# Altium schematic sheet [06] - MEMORY.SchDoc
size A3; DocumentNumber: 3; SheetNumber: 3; SheetTotal: 4
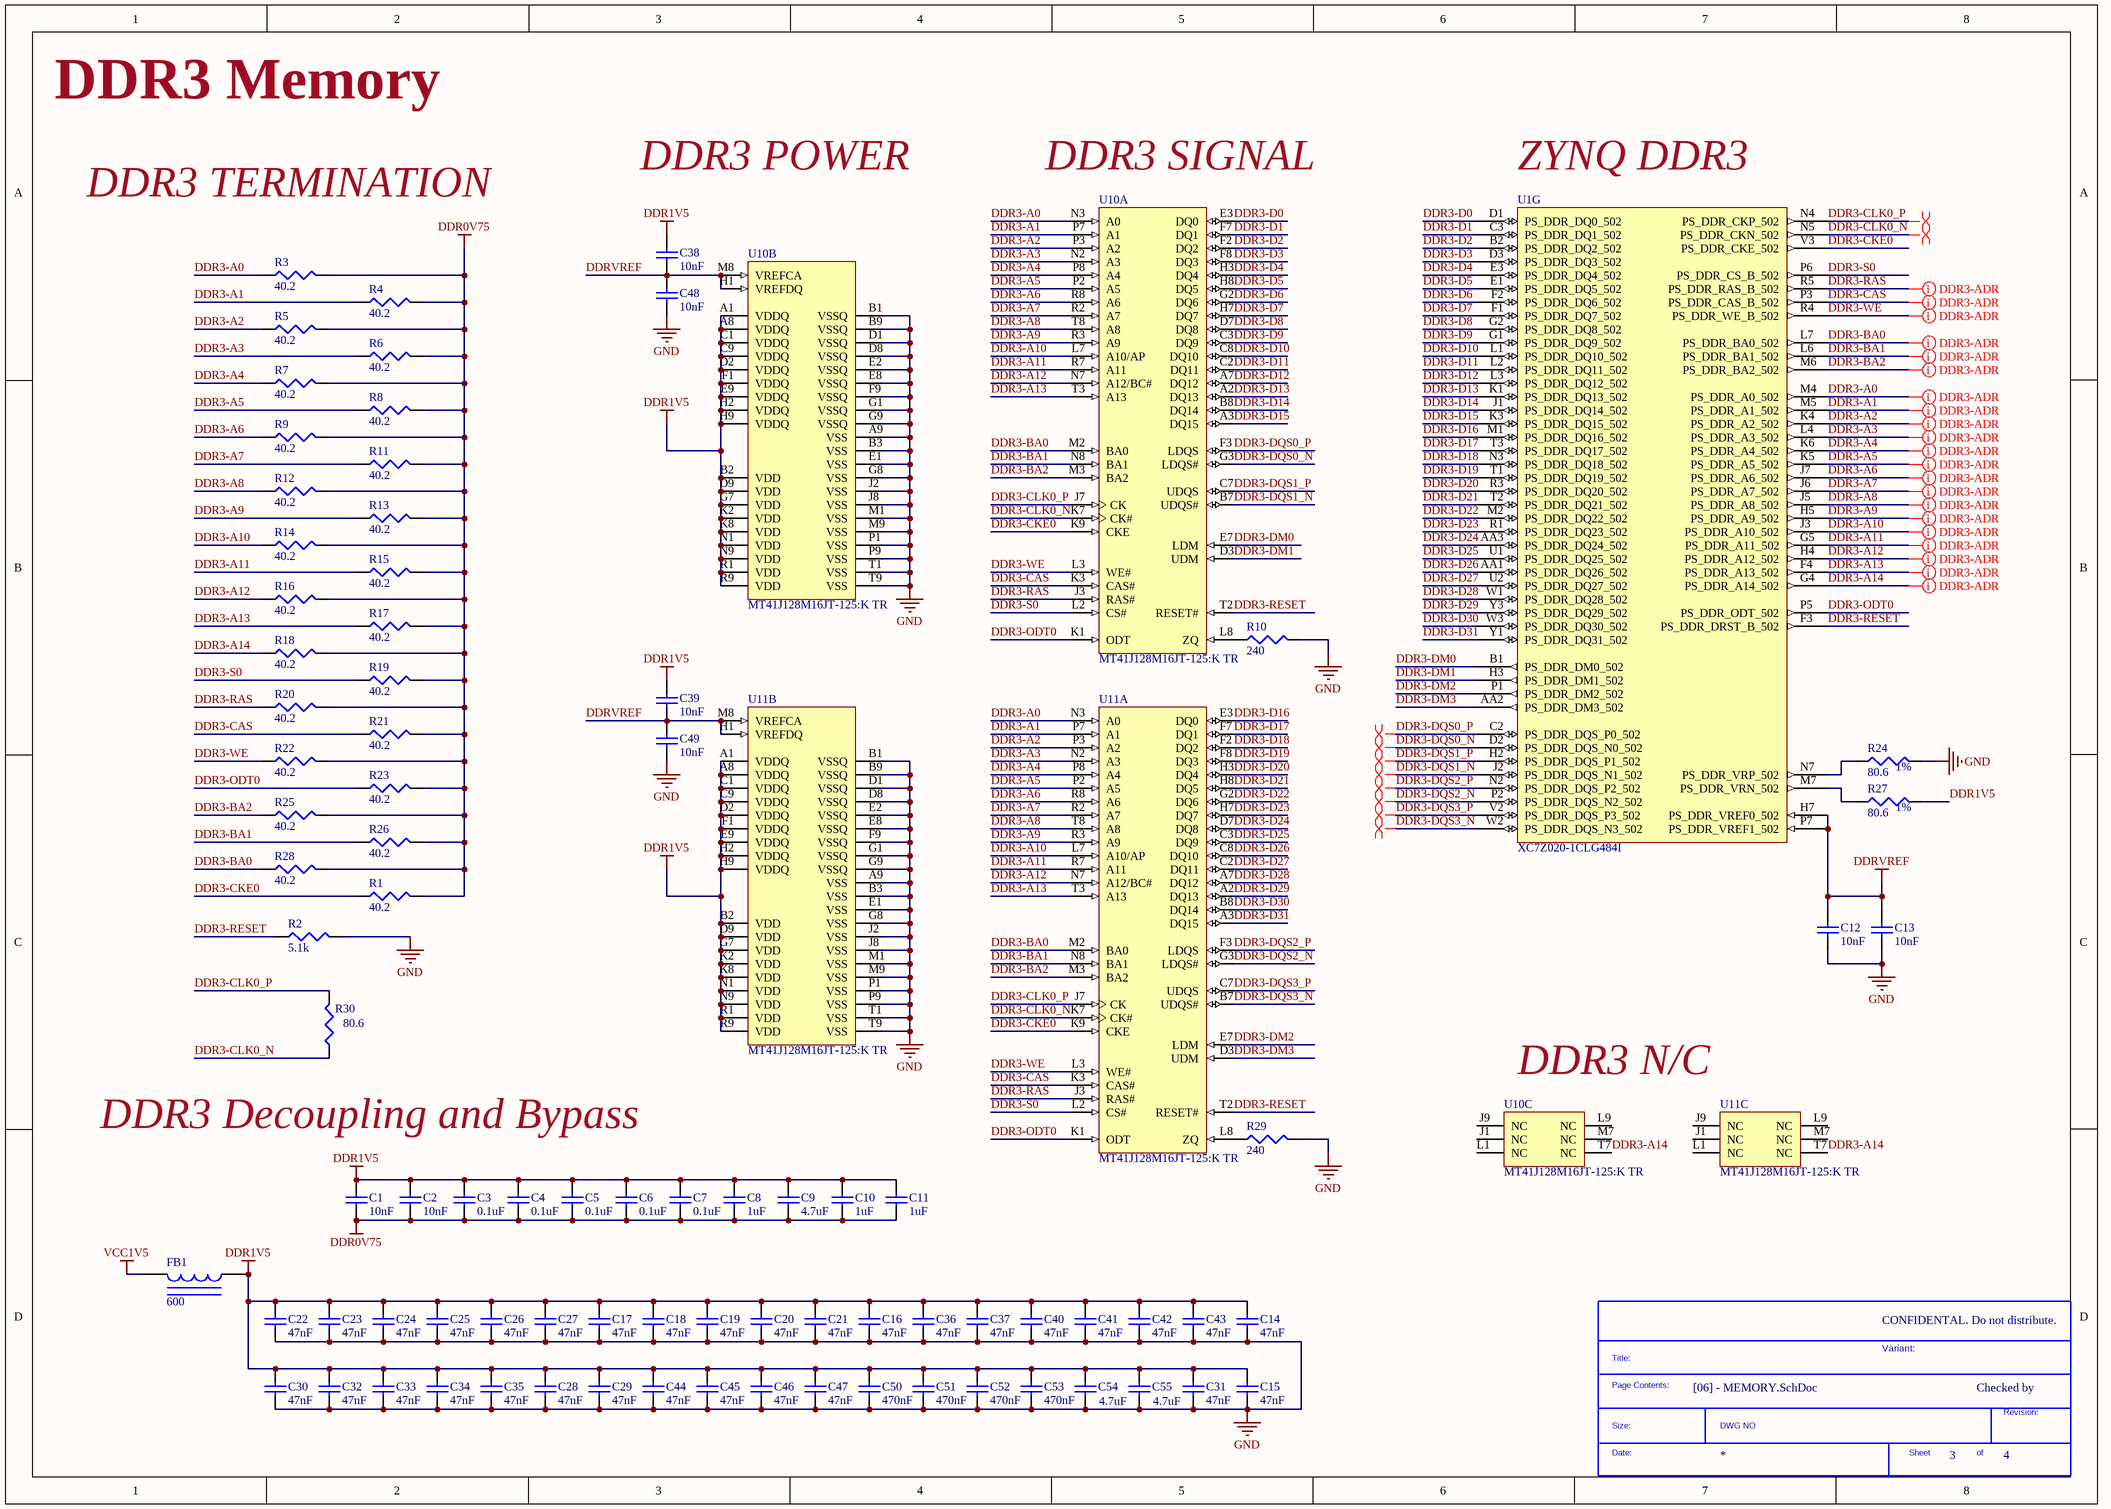
[diagram p0: [06] - MEMORY.SchDoc]

## Parts
*  SDTitleBlock  (value not drawn)  (graphical)
C1  value 10nF  [0402]  (hidden comment: Capacitor)
C2  value 10nF  [0402]  (hidden comment: Capacitor)
C3  value 0.1uF  [0402]  (hidden comment: Capacitor)
C4  value 0.1uF  [0402]  (hidden comment: Capacitor)
C5  value 0.1uF  [0402]  (hidden comment: Capacitor)
C6  value 0.1uF  [0402]  (hidden comment: Capacitor)
C7  value 0.1uF  [0402]  (hidden comment: Capacitor)
C8  value 1uF  [1608[0603]]  (hidden comment: Capacitor)
C9  value 4.7uF  [1608[0603]]  (hidden comment: Capacitor)
C10  value 1uF  [1608[0603]]  (hidden comment: Capacitor)
C11  value 1uF  [1608[0603]]  (hidden comment: Capacitor)
C12  value 10nF  [0402]  (hidden comment: Capacitor)
C13  value 10nF  [0402]  (hidden comment: Capacitor)
C14  value 47nF  [0402]  (hidden comment: Capacitor)
C15  value 47nF  [0402]  (hidden comment: Capacitor)
C16  value 47nF  [0402]  (hidden comment: Capacitor)
C17  value 47nF  [0402]  (hidden comment: Capacitor)
C18  value 47nF  [0402]  (hidden comment: Capacitor)
C19  value 47nF  [0402]  (hidden comment: Capacitor)
C20  value 47nF  [0402]  (hidden comment: Capacitor)
C21  value 47nF  [0402]  (hidden comment: Capacitor)
C22  value 47nF  [0402]  (hidden comment: Capacitor)
C23  value 47nF  [0402]  (hidden comment: Capacitor)
C24  value 47nF  [0402]  (hidden comment: Capacitor)
C25  value 47nF  [0402]  (hidden comment: Capacitor)
C26  value 47nF  [0402]  (hidden comment: Capacitor)
C27  value 47nF  [0402]  (hidden comment: Capacitor)
C28  value 47nF  [0402]  (hidden comment: Capacitor)
C29  value 47nF  [0402]  (hidden comment: Capacitor)
C30  value 47nF  [0402]  (hidden comment: Capacitor)
C31  value 47nF  [0402]  (hidden comment: Capacitor)
C32  value 47nF  [0402]  (hidden comment: Capacitor)
C33  value 47nF  [0402]  (hidden comment: Capacitor)
C34  value 47nF  [0402]  (hidden comment: Capacitor)
C35  value 47nF  [0402]  (hidden comment: Capacitor)
C36  value 47nF  [0402]  (hidden comment: Capacitor)
C37  value 47nF  [0402]  (hidden comment: Capacitor)
C38  value 10nF  [0402]  (hidden comment: Capacitor)
C39  value 10nF  [0402]  (hidden comment: Capacitor)
C40  value 47nF  [0402]  (hidden comment: Capacitor)
C41  value 47nF  [0402]  (hidden comment: Capacitor)
C42  value 47nF  [0402]  (hidden comment: Capacitor)
C43  value 47nF  [0402]  (hidden comment: Capacitor)
C44  value 47nF  [0402]  (hidden comment: Capacitor)
C45  value 47nF  [0402]  (hidden comment: Capacitor)
C46  value 47nF  [0402]  (hidden comment: Capacitor)
C47  value 47nF  [0402]  (hidden comment: Capacitor)
C48  value 10nF  [0402]  (hidden comment: Capacitor)
C49  value 10nF  [0402]  (hidden comment: Capacitor)
C50  value 470nF  [0402]  (hidden comment: Capacitor)
C51  value 470nF  [0402]  (hidden comment: Capacitor)
C52  value 470nF  [0402]  (hidden comment: Capacitor)
C53  value 470nF  [0402]  (hidden comment: Capacitor)
C54  value 4.7uF  [1608[0603]]  (hidden comment: Capacitor)
C55  value 4.7uF  [1608[0603]]  (hidden comment: Capacitor)
FB1  value 600  [6-0805_N]  (hidden comment: Ferrite Bead)
R1  value 40.2  [0402]  (hidden comment: Resistor)
R2  value 5.1k  [0402]  (hidden comment: Resistor)
R3  value 40.2  [0402]  (hidden comment: Resistor)
R4  value 40.2  [0402]  (hidden comment: Resistor)
R5  value 40.2  [0402]  (hidden comment: Resistor)
R6  value 40.2  [0402]  (hidden comment: Resistor)
R7  value 40.2  [0402]  (hidden comment: Resistor)
R8  value 40.2  [0402]  (hidden comment: Resistor)
R9  value 40.2  [0402]  (hidden comment: Resistor)
R10  value 240  [0402]  (hidden comment: Resistor)
R11  value 40.2  [0402]  (hidden comment: Resistor)
R12  value 40.2  [0402]  (hidden comment: Resistor)
R13  value 40.2  [0402]  (hidden comment: Resistor)
R14  value 40.2  [0402]  (hidden comment: Resistor)
R15  value 40.2  [0402]  (hidden comment: Resistor)
R16  value 40.2  [0402]  (hidden comment: Resistor)
R17  value 40.2  [0402]  (hidden comment: Resistor)
R18  value 40.2  [0402]  (hidden comment: Resistor)
R19  value 40.2  [0402]  (hidden comment: Resistor)
R20  value 40.2  [0402]  (hidden comment: Resistor)
R21  value 40.2  [0402]  (hidden comment: Resistor)
R22  value 40.2  [0402]  (hidden comment: Resistor)
R23  value 40.2  [0402]  (hidden comment: Resistor)
R24  value 80.6  Tolerance: 1%  [0402]  (hidden comment: Resistor)
R25  value 40.2  [0402]  (hidden comment: Resistor)
R26  value 40.2  [0402]  (hidden comment: Resistor)
R27  value 80.6  Tolerance: 1%  [0402]  (hidden comment: Resistor)
R28  value 40.2  [0402]  (hidden comment: Resistor)
R29  value 240  [0402]  (hidden comment: Resistor)
R30  value 80.6  [0402]  (hidden comment: Resistor)
U1  XC7Z020-1CLG484I  [CLG484]  (part G of 10)
U10  MT41J128M16JT-125:K TR  [MICT-JT-96]  (parts A,B,C of 3)
U11  MT41J128M16JT-125:K TR  [MICT-JT-96]  (parts A,B,C of 3)

## Nets
DDR0V75: C1.1 C2.1 C3.1 C4.1 C5.1 C6.1 C7.1 C8.1 C9.1 C10.1 C11.1 R1.2 R3.2 R4.2 R5.2 R6.2 R7.2 R8.2 R9.2 R11.2 R12.2 R13.2 R14.2 R15.2 R16.2 R17.2 R18.2 R19.2 R20.2 R21.2 R22.2 R23.2 R25.2 R26.2 R28.2
DDR1V5: C1.2 C2.2 C3.2 C4.2 C5.2 C6.2 C7.2 C8.2 C9.2 C10.2 C11.2 C14.2 C15.2 C16.2 C17.2 C18.2 C19.2 C20.2 C21.2 C22.2 C23.2 C24.2 C25.2 C26.2 C27.2 C28.2 C29.2 C30.2 C31.2 C32.2 C33.2 C34.2 C35.2 C36.2 C37.2 C38.2 C39.2 C40.2 C41.2 C42.2 C43.2 C44.2 C45.2 C46.2 C47.2 C50.2 C51.2 C52.2 C53.2 C54.2 C55.2 FB1.1 R27.2 U10.A1(VDDQ) U10.A8(VDDQ) U10.B2(VDD) U10.C1(VDDQ) U10.C9(VDDQ) U10.D2(VDDQ) U10.D9(VDD) U10.E9(VDDQ) U10.F1(VDDQ) U10.G7(VDD) U10.H2(VDDQ) U10.H9(VDDQ) U10.K2(VDD) U10.K8(VDD) U10.N1(VDD) U10.N9(VDD) U10.R1(VDD) U10.R9(VDD) U11.A1(VDDQ) U11.A8(VDDQ) U11.B2(VDD) U11.C1(VDDQ) U11.C9(VDDQ) U11.D2(VDDQ) U11.D9(VDD) U11.E9(VDDQ) U11.F1(VDDQ) U11.G7(VDD) U11.H2(VDDQ) U11.H9(VDDQ) U11.K2(VDD) U11.K8(VDD) U11.N1(VDD) U11.N9(VDD) U11.R1(VDD) U11.R9(VDD)
DDRVREF: C12.2 C13.2 C38.1 C39.1 C48.2 C49.2 U1.H7(PS_DDR_VREF0_502) U1.P7(PS_DDR_VREF1_502) U10.H1(VREFDQ) U10.M8(VREFCA) U11.H1(VREFDQ) U11.M8(VREFCA)
GND: C12.1 C13.1 C14.1 C15.1 C16.1 C17.1 C18.1 C19.1 C20.1 C21.1 C22.1 C23.1 C24.1 C25.1 C26.1 C27.1 C28.1 C29.1 C30.1 C31.1 C32.1 C33.1 C34.1 C35.1 C36.1 C37.1 C40.1 C41.1 C42.1 C43.1 C44.1 C45.1 C46.1 C47.1 C48.1 C49.1 C50.1 C51.1 C52.1 C53.1 C54.1 C55.1 R2.2 R10.2 R24.2 R29.2 U10.A9(VSS) U10.B1(VSSQ) U10.B3(VSS) U10.B9(VSSQ) U10.D1(VSSQ) U10.D8(VSSQ) U10.E1(VSS) U10.E2(VSSQ) U10.E8(VSSQ) U10.F9(VSSQ) U10.G1(VSSQ) U10.G8(VSS) U10.G9(VSSQ) U10.J2(VSS) U10.J8(VSS) U10.M1(VSS) U10.M9(VSS) U10.P1(VSS) U10.P9(VSS) U10.T1(VSS) U10.T9(VSS) U11.A9(VSS) U11.B1(VSSQ) U11.B3(VSS) U11.B9(VSSQ) U11.D1(VSSQ) U11.D8(VSSQ) U11.E1(VSS) U11.E2(VSSQ) U11.E8(VSSQ) U11.F9(VSSQ) U11.G1(VSSQ) U11.G8(VSS) U11.G9(VSSQ) U11.J2(VSS) U11.J8(VSS) U11.M1(VSS) U11.M9(VSS) U11.P1(VSS) U11.P9(VSS) U11.T1(VSS) U11.T9(VSS)
VCC1V5: FB1.2
DDR3-A0: R3.1 U1.M4(PS_DDR_A0_502) U10.N3(A0) U11.N3(A0)
DDR3-A1: R4.1 U1.M5(PS_DDR_A1_502) U10.P7(A1) U11.P7(A1)
DDR3-A2: R5.1 U1.K4(PS_DDR_A2_502) U10.P3(A2) U11.P3(A2)
DDR3-A3: R6.1 U1.L4(PS_DDR_A3_502) U10.N2(A3) U11.N2(A3)
DDR3-A4: R7.1 U1.K6(PS_DDR_A4_502) U10.P8(A4) U11.P8(A4)
DDR3-A5: R8.1 U1.K5(PS_DDR_A5_502) U10.P2(A5) U11.P2(A5)
DDR3-A6: R9.1 U1.J7(PS_DDR_A6_502) U10.R8(A6) U11.R8(A6)
DDR3-A7: R11.1 U1.J6(PS_DDR_A7_502) U10.R2(A7) U11.R2(A7)
DDR3-A8: R12.1 U1.J5(PS_DDR_A8_502) U10.T8(A8) U11.T8(A8)
DDR3-A9: R13.1 U1.H5(PS_DDR_A9_502) U10.R3(A9) U11.R3(A9)
DDR3-A10: R14.1 U1.J3(PS_DDR_A10_502) U10.L7(A10/AP) U11.L7(A10/AP)
DDR3-A11: R15.1 U1.G5(PS_DDR_A11_502) U10.R7(A11) U11.R7(A11)
DDR3-A12: R16.1 U1.H4(PS_DDR_A12_502) U10.N7(A12/BC#) U11.N7(A12/BC#)
DDR3-A13: R17.1 U1.F4(PS_DDR_A13_502) U10.T3(A13) U11.T3(A13)
DDR3-A14: R18.1 U1.G4(PS_DDR_A14_502) U10.T7(NC) U11.T7(NC)
DDR3-BA0: R28.1 U1.L7(PS_DDR_BA0_502) U10.M2(BA0) U11.M2(BA0)
DDR3-BA1: R26.1 U1.L6(PS_DDR_BA1_502) U10.N8(BA1) U11.N8(BA1)
DDR3-BA2: R25.1 U1.M6(PS_DDR_BA2_502) U10.M3(BA2) U11.M3(BA2)
DDR3-CAS: R21.1 U1.P3(PS_DDR_CAS_B_502) U10.K3(CAS#) U11.K3(CAS#)
DDR3-CKE0: R1.1 U1.V3(PS_DDR_CKE_502) U10.K9(CKE) U11.K9(CKE)
DDR3-CLK0_N: R30.1 U1.N5(PS_DDR_CKN_502) U10.K7(CK#) U11.K7(CK#)
DDR3-CLK0_P: R30.2 U1.N4(PS_DDR_CKP_502) U10.J7(CK) U11.J7(CK)
DDR3-D0: U1.D1(PS_DDR_DQ0_502) U10.E3(DQ0)
DDR3-D1: U1.C3(PS_DDR_DQ1_502) U10.F7(DQ1)
DDR3-D2: U1.B2(PS_DDR_DQ2_502) U10.F2(DQ2)
DDR3-D3: U1.D3(PS_DDR_DQ3_502) U10.F8(DQ3)
DDR3-D4: U1.E3(PS_DDR_DQ4_502) U10.H3(DQ4)
DDR3-D5: U1.E1(PS_DDR_DQ5_502) U10.H8(DQ5)
DDR3-D6: U1.F2(PS_DDR_DQ6_502) U10.G2(DQ6)
DDR3-D7: U1.F1(PS_DDR_DQ7_502) U10.H7(DQ7)
DDR3-D8: U1.G2(PS_DDR_DQ8_502) U10.D7(DQ8)
DDR3-D9: U1.G1(PS_DDR_DQ9_502) U10.C3(DQ9)
DDR3-D10: U1.L1(PS_DDR_DQ10_502) U10.C8(DQ10)
DDR3-D11: U1.L2(PS_DDR_DQ11_502) U10.C2(DQ11)
DDR3-D12: U1.L3(PS_DDR_DQ12_502) U10.A7(DQ12)
DDR3-D13: U1.K1(PS_DDR_DQ13_502) U10.A2(DQ13)
DDR3-D14: U1.J1(PS_DDR_DQ14_502) U10.B8(DQ14)
DDR3-D15: U1.K3(PS_DDR_DQ15_502) U10.A3(DQ15)
DDR3-D16: U1.M1(PS_DDR_DQ16_502) U11.E3(DQ0)
DDR3-D17: U1.T3(PS_DDR_DQ17_502) U11.F7(DQ1)
DDR3-D18: U1.N3(PS_DDR_DQ18_502) U11.F2(DQ2)
DDR3-D19: U1.T1(PS_DDR_DQ19_502) U11.F8(DQ3)
DDR3-D20: U1.R3(PS_DDR_DQ20_502) U11.H3(DQ4)
DDR3-D21: U1.T2(PS_DDR_DQ21_502) U11.H8(DQ5)
DDR3-D22: U1.M2(PS_DDR_DQ22_502) U11.G2(DQ6)
DDR3-D23: U1.R1(PS_DDR_DQ23_502) U11.H7(DQ7)
DDR3-D24: U1.AA3(PS_DDR_DQ24_502) U11.D7(DQ8)
DDR3-D25: U1.U1(PS_DDR_DQ25_502) U11.C3(DQ9)
DDR3-D26: U1.AA1(PS_DDR_DQ26_502) U11.C8(DQ10)
DDR3-D27: U1.U2(PS_DDR_DQ27_502) U11.C2(DQ11)
DDR3-D28: U1.W1(PS_DDR_DQ28_502) U11.A7(DQ12)
DDR3-D29: U1.Y3(PS_DDR_DQ29_502) U11.A2(DQ13)
DDR3-D30: U1.W3(PS_DDR_DQ30_502) U11.B8(DQ14)
DDR3-D31: U1.Y1(PS_DDR_DQ31_502) U11.A3(DQ15)
DDR3-DM0: U1.B1(PS_DDR_DM0_502) U10.E7(LDM)
DDR3-DM1: U1.H3(PS_DDR_DM1_502) U10.D3(UDM)
DDR3-DM2: U1.P1(PS_DDR_DM2_502) U11.E7(LDM)
DDR3-DM3: U1.AA2(PS_DDR_DM3_502) U11.D3(UDM)
DDR3-DQS0_N: U1.D2(PS_DDR_DQS_N0_502) U10.G3(LDQS#)
DDR3-DQS0_P: U1.C2(PS_DDR_DQS_P0_502) U10.F3(LDQS)
DDR3-DQS1_N: U1.J2(PS_DDR_DQS_N1_502) U10.B7(UDQS#)
DDR3-DQS1_P: U1.H2(PS_DDR_DQS_P1_502) U10.C7(UDQS)
DDR3-DQS2_N: U1.P2(PS_DDR_DQS_N2_502) U11.G3(LDQS#)
DDR3-DQS2_P: U1.N2(PS_DDR_DQS_P2_502) U11.F3(LDQS)
DDR3-DQS3_N: U1.W2(PS_DDR_DQS_N3_502) U11.B7(UDQS#)
DDR3-DQS3_P: U1.V2(PS_DDR_DQS_P3_502) U11.C7(UDQS)
DDR3-ODT0: R23.1 U1.P5(PS_DDR_ODT_502) U10.K1(ODT) U11.K1(ODT)
DDR3-RAS: R20.1 U1.R5(PS_DDR_RAS_B_502) U10.J3(RAS#) U11.J3(RAS#)
DDR3-RESET: R2.1 U1.F3(PS_DDR_DRST_B_502) U10.T2(RESET#) U11.T2(RESET#)
DDR3-S0: R19.1 U1.P6(PS_DDR_CS_B_502) U10.L2(CS#) U11.L2(CS#)
DDR3-WE: R22.1 U1.R4(PS_DDR_WE_B_502) U10.L3(WE#) U11.L3(WE#)
NetR10_1: R10.1 U10.L8(ZQ)
NetR24_1: R24.1 U1.N7(PS_DDR_VRP_502)
NetR27_1: R27.1 U1.M7(PS_DDR_VRN_502)
NetR29_1: R29.1 U11.L8(ZQ)

Not connected (* = marked no-connect by the designer): U10 J1(NC) J9(NC) L1(NC) L9(NC) M7(NC); U11 J1(NC) J9(NC) L1(NC) L9(NC) M7(NC)

## Layout directives
differential pair: DDR3-CLK0_N, DDR3-CLK0_P, DDR3-DQS0_N, DDR3-DQS0_P, DDR3-DQS1_N, DDR3-DQS1_P, DDR3-DQS2_N, DDR3-DQS2_P, DDR3-DQS3_N, DDR3-DQS3_P
net class DDR3-ADR: DDR3-A0, DDR3-A1, DDR3-A2, DDR3-A3, DDR3-A4, DDR3-A5, DDR3-A6, DDR3-A7, DDR3-A8, DDR3-A9, DDR3-A10, DDR3-A11, DDR3-A12, DDR3-A13, DDR3-A14, DDR3-BA0, DDR3-BA1, DDR3-BA2, DDR3-CAS, DDR3-RAS, DDR3-WE

## Notes on the sheet
- DDR3 Memory
- DDR3 POWER
- (near U10) DDR3 SIGNAL
- (near U1) ZYNQ DDR3
- DDR3 TERMINATION
- DDR3 N/C
- DDR3 Decoupling and Bypass
- CONFIDENTAL. Do not distribute.
- CLOCKS (CPU & PCIE)
- Variant:
- Checked by
- (in symbol SDTitleBlock) Title:; Page Contents:; Revision:; Size:; DWG NO; Date:; Sheet; of

## Library data of the parts
C1-C55 = Cap Semi: Capacitor (Semiconductor SIM Model); Published: 8-Jun-2000; LatestRevisionDate: 29-May-2009; LatestRevisionNote: IPC-7351 Footprint Added.; PackageReference: C1206; Publisher: Altium Limited; PackageDescription: Chip Capacitor
FB1 = Inductor Iron: Magnetic-Core Inductor; Published: 24-Mar-1999; LatestRevisionDate: 17-Jul-2002; LatestRevisionNote: Re-released for DXP Platform.; PackageReference: AXIAL-0.9; Publisher: Altium Limited; PackageDescription: Axial Device, Thru-Hole; 2 Leads; 0.9 in Pin Spacing
R1-R29 = Res3: Published: 8-Jun-2000; LatestRevisionDate: 29-May-2009; LatestRevisionNote: IPC-7351 Footprint Added.; PackageReference: J1-0603; Publisher: Altium Limited; PackageDescription: Chip Resistor
R30 = Res3: Tolerance: 1%; Published: 8-Jun-2000; LatestRevisionDate: 29-May-2009; LatestRevisionNote: IPC-7351 Footprint Added.; PackageReference: J1-0603; Publisher: Altium Limited; PackageDescription: Chip Resistor
U1 = XC7Z020-1CLG484I: IC SOC CORTEX-A9 ARTIX-7 484BGA; Manufacturer: Xilinx Inc.; Architecture: MCU, FPGA; Core Processor: Dual ARM® Cortex®-A9 MPCore™ with CoreSight™; MCU RAM: 256KB; Peripherals: DMA; Connectivity: CAN, EBI/EMI, Ethernet, I²C, MMC/SD/SDIO, SPI, UART/USART, USB OTG; Speed: 667MHz; Primary Attributes: Artix™-7 FPGA, 85K Logic Cells; Number of I/O: 130; Supplier 1: Digi-Key; Manufacturer Part Number: XC7Z020-1CLG484I; RoHS: RoHS Compliant; Category: Integrated Circuits (ICs); Stock 1: 188; Pricing 1: 1=128.75 (USD); Packaging: Tray; MCU Flash: -; Operating Temperature: -40°C ~ 100°C; Package / Case: 484-LFBGA, CSPBGA; Supplier Device Package: 484-CSPBGA (19x19); ComponentLink1URL: http://www.xilinx.com/support/documentation/data_sheets/ds190-Zynq-7000-Overview.pdf; ComponentLink1Description: http://www.xilinx.com/support/documentation/data_sheets/ds190-Zynq-7000-Overview.pdf; Supplier Part Number 1: 122-1849-ND
U10 U11 = MT41J128M16JT-125:K TR: IC DDR3 SDRAM 2GBIT 96FBGA; Manufacturer: Micron Technology Inc.; Format - Memory: RAM; Memory Size: 2G (128M x 16); Speed: 1.25ns; Interface: Parallel; Voltage - Supply: 1.425 V ~ 1.575 V; Supplier 1: Digi-Key; Manufacturer Part Number: MT41J128M16JT-125:K TR; RoHS: RoHS Compliant; Category: Integrated Circuits (ICs); Stock 1: 3472; Pricing 1: 1=4.47, 10=4.054, 25=3.966, 50=3.944, 100=3.538, 250=3.524, 500=3.394, 1000=3.228 (USD); Packaging: Cut Tape (CT); Memory Type: DDR3 SDRAM; Operating Temperature: 0°C ~ 95°C (TC); Package / Case: 96-TFBGA; Supplier Device Package: 96-FBGA (8x14); ComponentLink1URL: http://www.micron.com/~/media/Documents/Products/Data%20Sheet/DRAM/DDR3/2Gb_DDR3_SDRAM.pdf; ComponentLink1Description: http://www.micron.com/~/media/Documents/Products/Data%20Sheet/DRAM/DDR3/2Gb_DDR3_SDRAM.pdf; Supplier Part Number 1: 557-1611-1-ND